# Altium schematic sheet ST7735_Extend.SchDoc
size A4
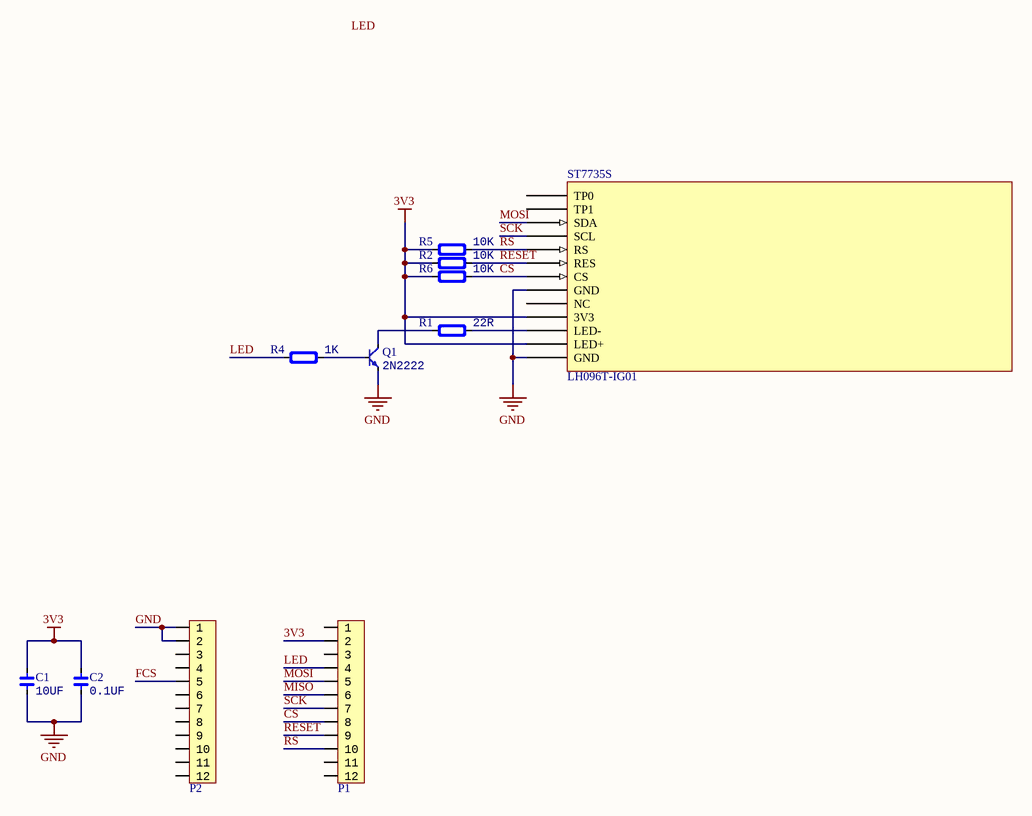
[diagram p0: ST7735_Extend.SchDoc]

## Parts
C1  value 10UF  [CAP_0603]  (hidden comment: C0603)
C2  value 0.1UF  [CAP_0603]  (hidden comment: C0603)
P1  HDR1x12_2.54  [HDR1X12_2.54_180F]  (value not drawn)
P2  HDR1x12_2.54  [HDR1X12_2.54_180F]  (value not drawn)
Q1  2N2222  [SOT23-3]
R1  value 22R  [RES_0603]  (hidden comment: R0603)
R2  value 10K  [RES_0603]  (hidden comment: R0603)
R4  value 1K  [RES_0603]  (hidden comment: R0603)
R5  value 10K  [RES_0603]  (hidden comment: R0603)
R6  value 10K  [RES_0603]  (hidden comment: R0603)
ST7735S  LH096T-IG01  [LH096T-IG01]

## Nets
3V3: C1.2 C2.2 P1.2 R2.1 R5.1 R6.1 ST7735S.9(3V3) ST7735S.11(LED+)
GND: C1.1 C2.1 P2.1 P2.2 Q1.2(E) ST7735S.7(GND) ST7735S.12(GND)
CS: P1.8 R6.2 ST7735S.6(CS)
FCS: P2.5
LED: P1.4 R4.1
MISO: P1.6
MOSI: P1.5 ST7735S.2(SDA)
RESET: P1.9 R2.2 ST7735S.5(RES)
RS: P1.10 R5.2 ST7735S.4(RS)
SCK: P1.7 ST7735S.3(SCL)
NetQ1_1: Q1.1(B) R4.2
NetQ1_3: Q1.3(C) R1.1
NetR1_2: R1.2 ST7735S.10(LED-)

Not connected (* = marked no-connect by the designer): P1 1 3 11 12; P2 3 4 6 7 8 9 10 11 12; ST7735S 0(TP0) 1(TP1) 8(NC)

## Notes on the sheet
- Labels drawn without touching a wire or pin: LED

## Library data of the parts
C1 C2 = Cap_0603: Capacitor; Specification: X7R 50V; Type: 0603; Manufacturer: *
P1 P2 = HDR1x12_2.54: Header
Q1 = BJT_NPN: Transistor; Type: NPN; Value: 2N2222
R1 R2 R4-R6 = Res_0603: Resistor; Specification: ±5%; Manufacturer: *; Type: 0603